# EAGLE design drawdio (EAGLE 7.7.0)
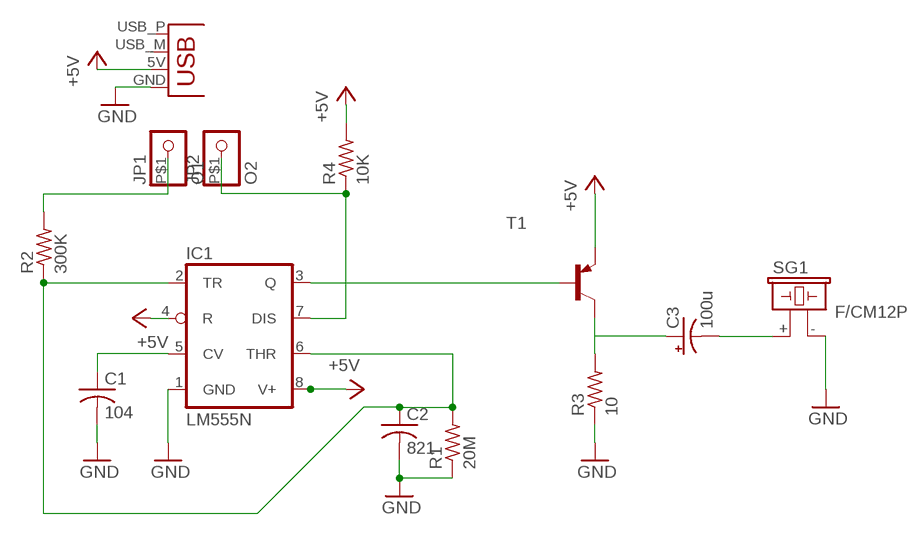
[diagram p0: schematic, sheet 1]

## Parts
C1  104  C-US025-030X050  [C025-030X050]
C2  821  C-US050-024X044  [C050-024X044]
C3  100u  CPOL-USE2,5-6E  [E2,5-6E]
IC1  LM555N  [DIL08]
JP1  O1  PINHD-1X1-BIGPOGO  [1X1-BIGPOGO]
JP2  O2  PINHD-1X1-BIGPOGO  [1X1-BIGPOGO]
R1  20M  R-US_0207/7  [0207/7]
R2  300K  R-US_0207/7  [0207/7]
R3  10  R-US_0207/7  [0207/7]
R4  10K  R-US_0207/7  [0207/7]
SG1  F/CM12P  [F/CM12P]
T1  MPS2907A-PNP-TO92-CBE  [TO92-CBE]
X1  USBPCB  [USB-A-PCB]

## Nets
+5V: IC1.4(R) IC1.8(V+) R4.2 T1.E X1.5V(VBUS)
GND: C1.2 C2.2 IC1.1(GND) R1.1 R3.1 SG1.- X1.GND
N$1: C1.1 IC1.5(CV)
N$2: C2.1 IC1.2(TR) IC1.6(THR) R1.2 R2.1
N$3: C3.- SG1.+
N$4: JP1.P$1 R2.2
N$5: IC1.7(DIS) JP2.P$1 R4.1
N$6: IC1.3(Q) T1.B
N$7: C3.+ R3.2 T1.C
Unconnected: X1.USB_M(D-) X1.USB_P(D+)

## Library data of the parts
C1 C2 = adafruit:C-US: CAPACITOR, American symbol
C3 = adafruit:CPOL-US: POLARIZED CAPACITOR, American symbol
IC1 = linear:*555: TIMER
JP1 JP2 = adafruit:PINHD-1X1: Pin header 1x1 for 0.1" spacing With round pins
R1-R4 = rcl:R-US_: RESISTOR, American symbol; SPICEPREFIX: R
SG1 = buzzer:F/CM12P: BUZZER Source: Buerklin; OC_FARNELL: unknown; OC_NEWARK: unknown
T1 = transistor:*-PNP-: PNP Transistror
X1 = SparkFun:USB: USB Connectors USB-B-PTH is fully proven SKU : PRT-00139 USB-miniB is fully proven SKU : PRT-00587 USB-A-PCB is untested. USB-A-H is throughly reviewed, but untested. Spark Fun Electronics SKU : PRT-00437 USB-B-SMT is throughly reviewed, but untested. Needs silkscreen touching up. USB-A-S has not been used/tested USB-MB-H has not been used/tested

## Board
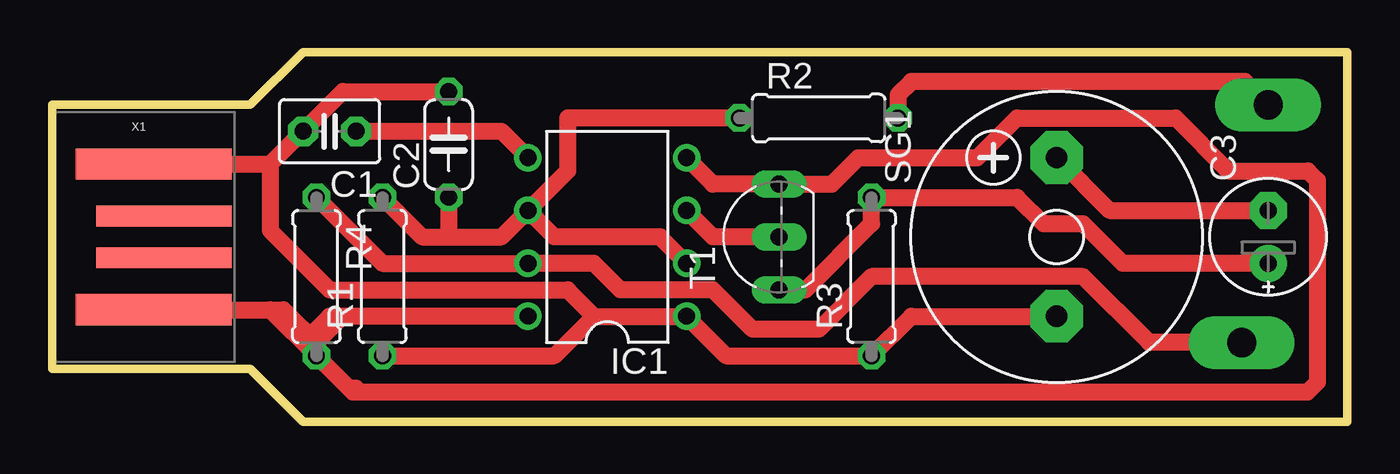
[diagram p1: board, top side]

Size 62.23 x 17.78 mm. Coordinates in mm from the lower left corner, seen from the top.
Outline: 62.21,0 62.21,17.78 12.06,17.78
Outline: 12.06,17.78 9.53,15.24 0,15.24 0,2.54 9.53,2.54 12.06,0 62.23,0 62.23,17.78 12.06,17.78
Copper layers (1*16): Top 0.035mm / dielectric 1.5mm / Bottom 0.035mm
Design rules "default": minimum track width 6mil, minimum drill 0.35mm, track to track 6mil, track to pad 6mil, pad to pad 6mil, via to via 6mil, smd to smd 6mil, copper to edge 40mil, drill to drill 6mil, minimum pad ring 10mil, minimum via ring 8mil, stop-mask expansion 4mil, vias tented up to drill 0mil, thermal gap 10mil

### Footprints (pad centres in the part's own frame; a part is rotated, then mirrored left to right if it is on the bottom)
C025-030X050 = drill 0.813 pad 1.422 octagon: 1 -1.27,0; 2 1.27,0
C050-024X044 = drill 0.813 octagon: 1 -2.54,0; 2 2.54,0
E2,5-6E = drill 0.813 pad 1.778: + -1.27,0 | drill 0.813 pad 1.778 octagon: - 1.27,0
DIL08 = drill 0.813 pad 1.27: 1 -3.81,-3.81; 2 -1.27,-3.81; 3 1.27,-3.81; 4 3.81,-3.81; 5 3.81,3.81; 6 1.27,3.81; 7 -1.27,3.81; 8 -3.81,3.81
1X1-BIGPOGO = drill 1.4 pad 2.54 long: P$1 0,0
0207/7 = drill 0.813 octagon: 1 -3.81,0; 2 3.81,0
F/CM12P = drill 1.016 pad 2.54 octagon: + 3.81,0; - -3.81,0
TO92-CBE = drill 0.813 long: B 0,0; C -2.54,0; E 2.54,0
USB-A-PCB = smd 7.5 x 1.5: 5V -0.2,-3.5; GND -0.2,3.5 | smd 6.5 x 1: USB_M 0.3,-1; USB_P 0.3,1

### Placement (x,y rotation side)
C1  13.34,13.97 180 top
C2  19.05,13.34 90 top
C3  58.42,8.89 90 top
IC1  26.67,8.89 90 top
JP1  58.42,15.24 0 top
JP2  57.15,3.81 0 top
R1  15.88,6.99 90 top
R2  36.83,14.61 0 top
R3  39.37,6.99 90 top
R4  12.7,6.99 270 top
SG1  48.26,8.89 90 top
T1  34.92,8.89 90 top
X1  5.08,8.89 0 top

### Tracks (layer width: path | path; a pad name or v marks a point on that pad's centre or on a via)
+5V
  Top 0.813: 12.06,3.81 12.06,4.45 11.12,5.39 X1.5V 10.48,5.39 R4.2 | 12.06,3.81 R4.2 | IC1.8 13.97,5.08 | 13.97,5.08 13.34,5.08 12.06,3.81 | IC1.4 31.75,11.43 T1.E 37.47,11.43 38.73,12.7 44.45,12.7 46.35,14.61 53.98,14.61 56.52,12.06 60.33,12.06 60.79,11.6 60.79,1.91 60.3,1.42 22.86,1.42 14.61,1.42 14.45,1.42 R4.2 | 13.97,5.08 12.7,3.81 R4.2 | R4.2 14.25,1.63 14.61,1.63
GND
  Top 0.813: C2.2 13.97,15.88 C1.2 10.48,12.39 | X1.GND 10.48,12.39 | 10.48,12.39 10.48,9.2 13.34,6.35 24.77,6.35 26.04,5.08 | 26.04,5.08 IC1.1 32.38,3.17 R3.1 41.27,5.08 SG1.- | R1.1 24.13,3.17 26.04,5.08
N$1
  Top 0.813: C1.1 21.59,13.97 IC1.5
N$2
  Top 0.813: IC1.6 21.59,8.89 19.05,8.89 | C2.1 19.05,8.89 | IC1.2 29.21,8.89 24.13,8.89 IC1.6 | R2.1 24.77,14.61 24.77,12.06 IC1.6 | R1.2 17.78,8.89 19.05,8.89
N$3
  Top 0.813: SG1.+ 50.8,10.16 C3.-
N$4
  Top 0.813: JP1.P$1 57.3,16.36 41.27,16.36 40.64,15.72 R2.2
N$5
  Top 0.813: JP2.P$1 52.7,3.81 49.53,6.99 39.37,6.99 36.83,4.45 33.66,4.45 31.75,6.35 27.3,6.35 26.04,7.62 IC1.7 15.88,7.62 R4.1
N$6
  Top 0.813: T1.B 31.75,8.89 IC1.3
N$7
  Top 0.813: C3.+ 51.44,7.62 49.53,9.53 47.62,9.53 46.35,10.79 R3.2 39.37,9.53 36.2,6.35 T1.C